# EAGLE design PCB-JOY-4AXIS_v07-18_adaptorHirose (EAGLE 7.7.0)
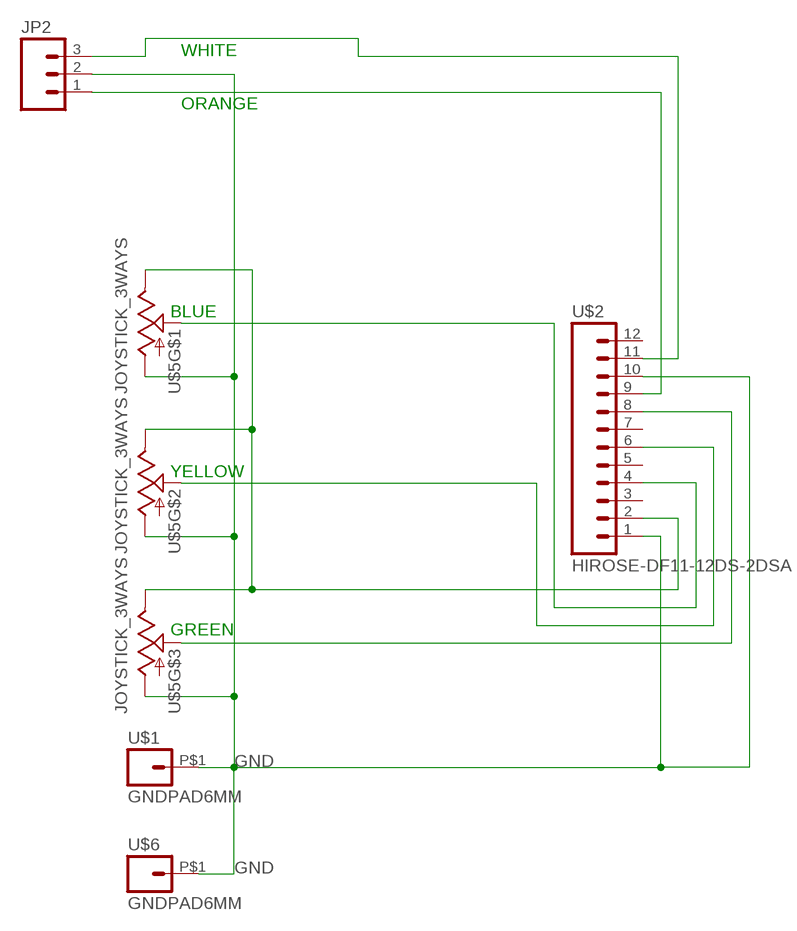
[diagram p0: schematic, sheet 1]

## Parts
JP2  M03PTH  [1X03]
U$1  GNDPAD6MM  [3.2MMPAD6MM]
U$2  HIROSE-DF11-12DS-2DSA  [2X6HIROSE_DF11-12DS-2DSA]
U$5  JOYSTICK_3WAYS  [JOYSTICK]
U$6  GNDPAD6MM  [3.2MMPAD6MM]

## Nets
GND [Power]: JP2.2 U$1.P$1 U$2.1 U$2.10 U$5.LR_COM(A) U$5.ROT_COM(A) U$5.UD_COM(A) U$6.P$1
N$1: U$2.2 U$5.LR_V(E) U$5.ROT_V(E) U$5.UD_V(E)
N$2: U$2.4 U$5.LR_C(S)
N$3: U$2.6 U$5.UD_C(S)
N$4: U$2.8 U$5.ROT_C(S)
N$5: JP2.1 U$2.9
N$6: JP2.3 U$2.11
Unconnected: U$2.3 U$2.5 U$2.7 U$2.12

## Notes on the sheet
- WHITE
- ORANGE
- BLUE
- YELLOW
- GREEN

## Library data of the parts
JP2 = SparkFun:M03: Header 3 Standard 3-pin 0.1" header. Use with straight break away headers (SKU : PRT-00116), right angle break away headers (PRT-00553), swiss pins (PRT-00743), machine pins (PRT-00117), and female headers (PRT-00115). Molex polarized connector foot print use with SKU : PRT-08232 with associated crimp pins and housings.
U$1 U$6 = SKAARHOJ:GNDPAD
U$2 = SKAARHOJ:HIROSE-DF11-12DS-2DSA
U$5 = SKAARHOJ:JOYSTICK_3WAYS

## Net classes
0 default: width 0.203 mm, drill 0.406 mm, clearance 0.203 mm
1 Power: width 0.305 mm, drill 0.61 mm, clearance 0.203 mm

## Board
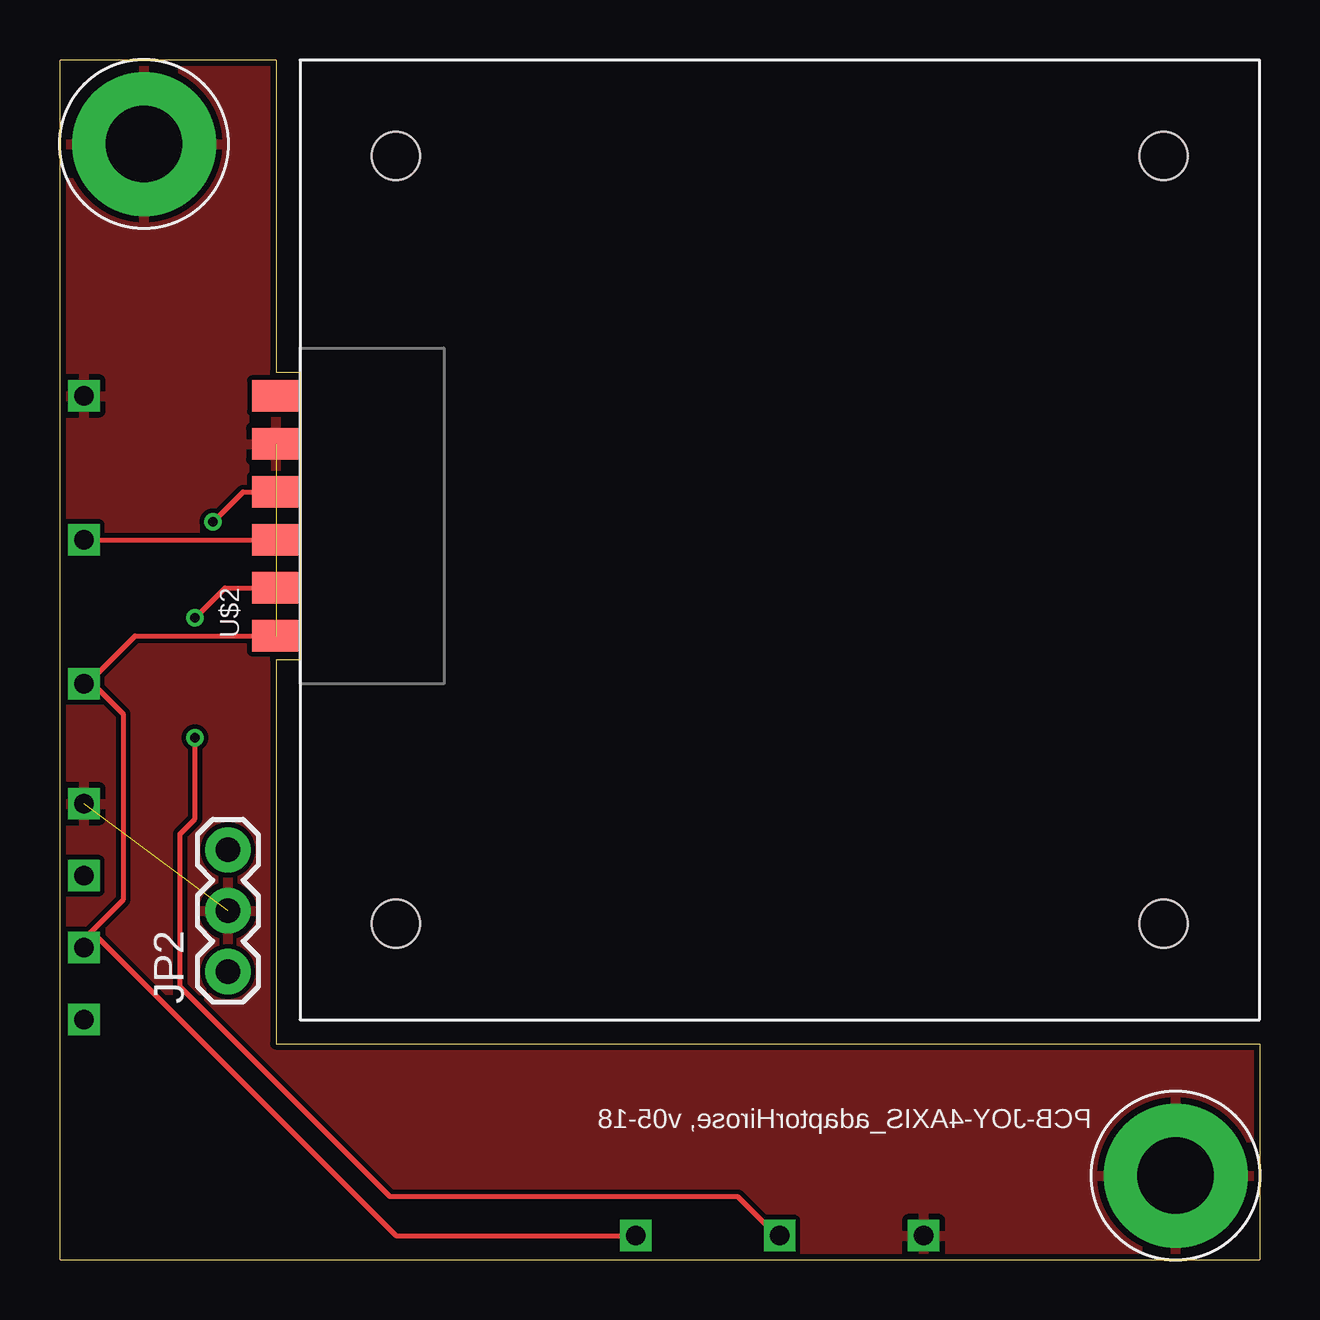
[diagram p1: board, top side]
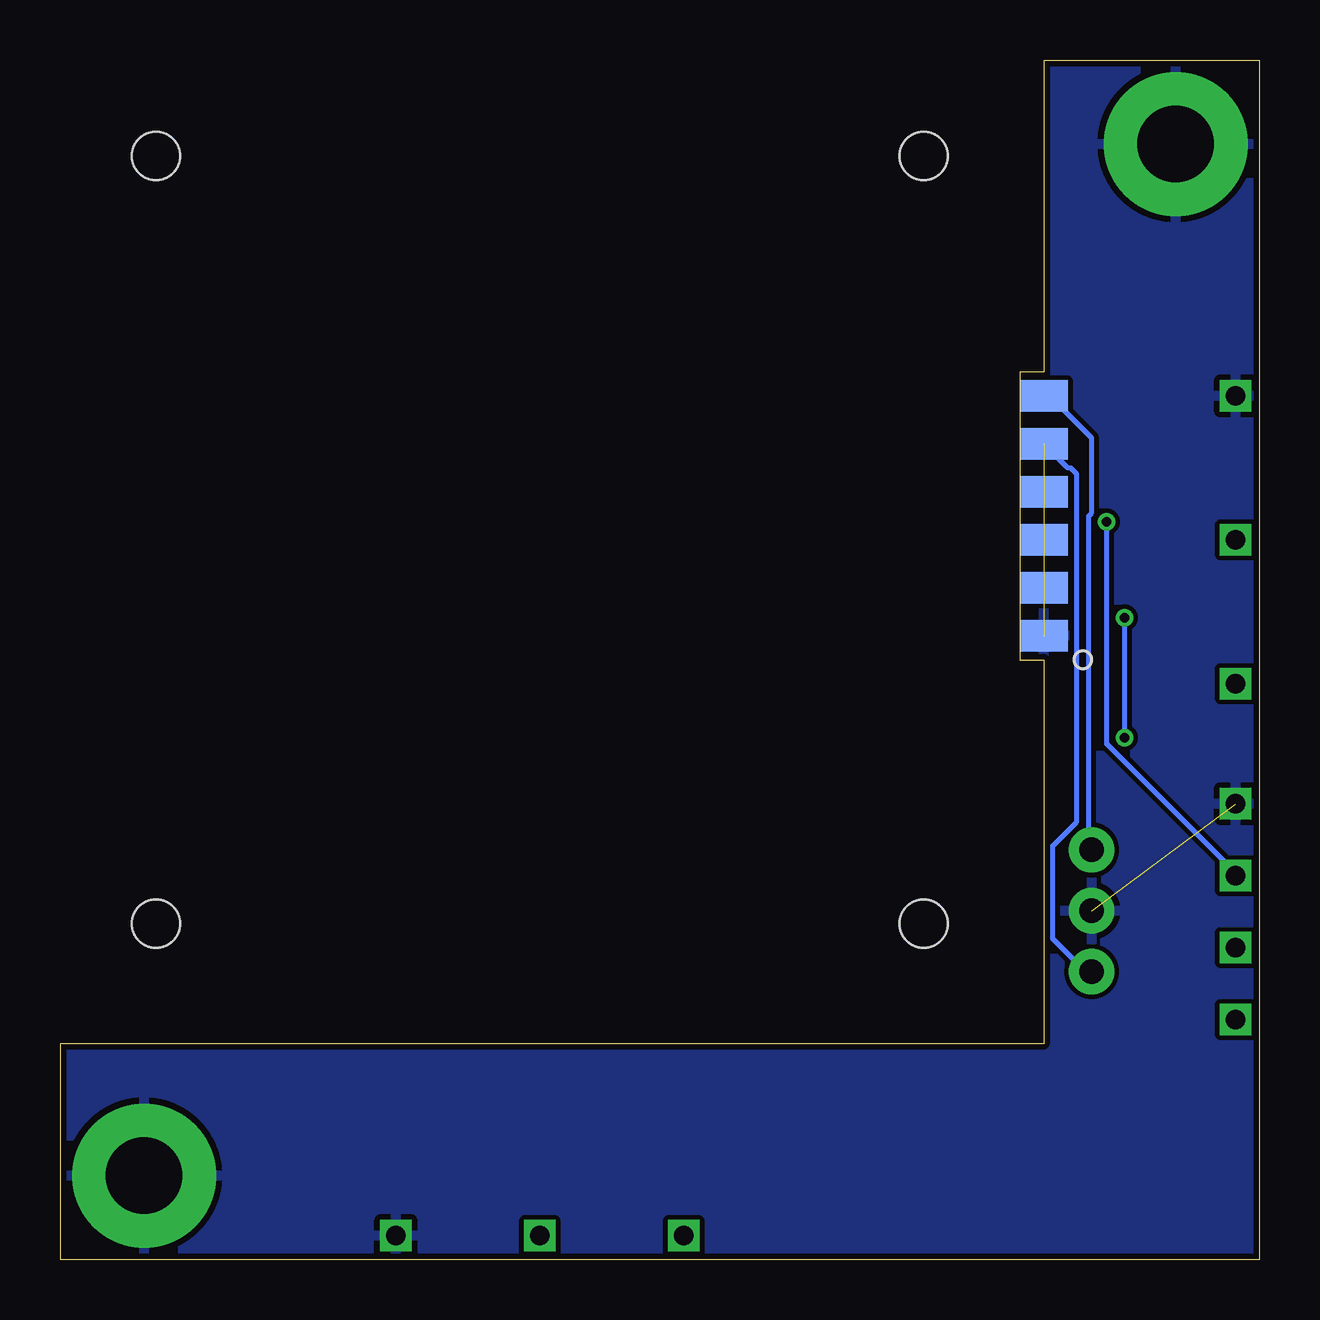
[diagram p2: board, bottom side, seen from below]

Size 50 x 50 mm. Coordinates in mm from the lower left corner, seen from the top.
Outline: 0,0 50,0 50,9 9,9 9,25 10,25 10,37 9,37 9,50 0,50 0,0
Copper layers (1*16): Top 0.035mm / dielectric 1.5mm / Bottom 0.035mm
Design rules "Fusion_eagle_rule_v1.1": minimum track width 6mil, minimum drill 12mil, track to track 6mil, track to pad 6mil, pad to pad 6mil, via to via 6mil, smd to smd 0mil, copper to edge 10mil, drill to drill 10mil, minimum pad ring 10mil, minimum via ring 6mil, stop-mask expansion 2mil, vias tented up to drill 100mil, thermal gap 10mil

### Footprints (pad centres in the part's own frame; a part is rotated, then mirrored left to right if it is on the bottom)
1X03 = drill 1.016 pad 1.88: 1 0,0; 2 2.54,0; 3 5.08,0
3.2MMPAD6MM = drill 3.2 pad 6: P$1 0,0
2X6HIROSE_DF11-12DS-2DSA = smd 2 x 1.3 bottom: 1 -1,-5; 3 -1,-3; 5 -1,-1; 7 -1,1; 9 -1,3; 11 -1,5 | smd 2 x 1.3: 2 -1,-5; 4 -1,-3; 6 -1,-1; 8 -1,1; 10 -1,3; 12 -1,5
JOYSTICK = drill 0.8 square: LR_C 0,29; LR_COM -6,29; LR_V 6,29; PUSH 29,20; ROT_C 29,14; ROT_COM 29,11; ROT_V 29,17; UD_C 29,0; UD_COM 29,-6; UD_V 29,6 | hole 2: -16,16; 16,16; 16,-16; -16,-16

### Placement (x,y rotation side)
JP2  7,12 90 top
U$1  3.5,46.5 0 top
U$2  10,31 0 top
U$5  30,30 180 top
U$6  46.5,3.5 0 top

### Tracks (layer width: path | path; a pad name or v marks a point on that pad's centre or on a via)
GND  (2 unrouted)
  pour Bottom: 0,0 50,0 50,50 0,50
  pour Top: 0,0 50,0 50,50 0,50
N$1
  Top 0.203: U$2.2 3.12,26 1.25,24.12 | 1.25,24.12 1.12,24 U$5.UD_V 1.25,24.12 | 1.25,24.12 2.62,22.75 2.62,15 1,13.38 U$5.ROT_V 1.38,13.62 14,1 U$5.LR_V
N$2  (via drill 0.41)
  Top 0.203: U$2.4 6.88,28 v5.62,26.75 | v5.62,21.75 5.62,18.38 5,17.75 5,11.38 13.75,2.62 28.25,2.62 29.88,1 U$5.LR_C
  Bottom 0.203: v5.62,21.75 v5.62,26.75
N$3
  Top 0.203: U$5.UD_C U$2.6
N$4  (via drill 0.41)
  Top 0.203: U$2.8 7.62,32 v6.38,30.75
  Bottom 0.203: v6.38,30.75 6.38,21.5 1,16.12 U$5.ROT_C
N$5
  Bottom 0.203: U$2.9 8,33 7.88,33 7.62,32.75 7.62,18.25 8.62,17.25 8.62,13.38 7.25,12 JP2.1
N$6
  Bottom 0.203: U$2.11 8.75,36 7,34.25 7,31.12 7.12,31 7.12,17.25 7,17.12 JP2.3

### Text on the board
_tsilk: PCB-JOY-4AXIS_adaptorHirose, v05-18